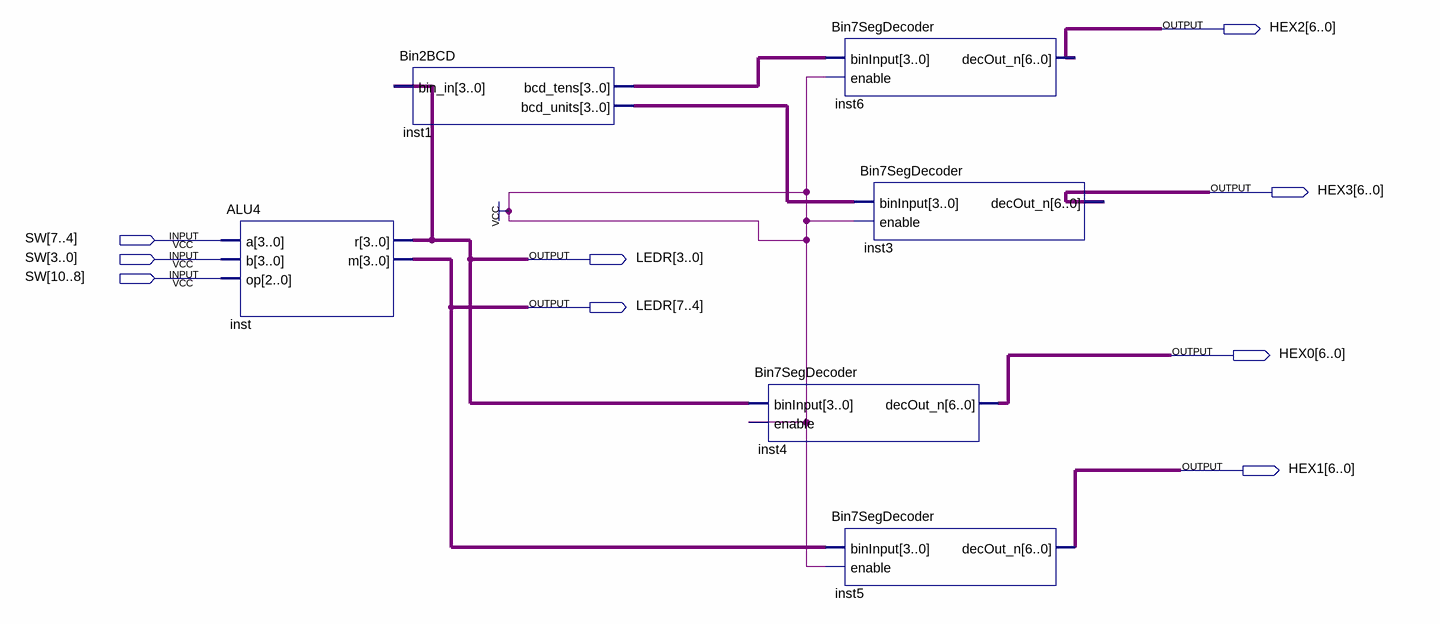
[diagram p0: schematic sheet]
// Quartus schematic ALUDemo.bdf as structural Verilog: 6 symbols, 9 pins
module ALUDemo (
  input  [10:0] SW,
  output [6:0] HEX2,
  output [6:0] HEX3,
  output [7:0] LEDR,
  output [6:0] HEX0,
  output [6:0] HEX1
);

  wire [3:0] inst1_bcd_tens, inst1_bcd_units;

  ALU4 inst (.a(SW[7:4]), .b(SW[3:0]), .op(SW[10:8]), .r(LEDR[3:0]), .m(LEDR[7:4]));
  Bin2BCD inst1 (.bin_in(LEDR[3:0]), .bcd_tens(inst1_bcd_tens), .bcd_units(inst1_bcd_units));
  Bin7SegDecoder inst4 (.binInput(LEDR[3:0]), .enable(1'b1), .decOut_n(HEX0));
  Bin7SegDecoder inst6 (.binInput(inst1_bcd_tens), .enable(1'b1), .decOut_n(HEX2));
  Bin7SegDecoder inst5 (.binInput(LEDR[7:4]), .enable(1'b1), .decOut_n(HEX1));
  Bin7SegDecoder inst3 (.binInput(inst1_bcd_units), .enable(1'b1), .decOut_n(HEX3));
endmodule
